# EAGLE schematic e-ink-display-v120 (EAGLE 9.2.2)
CNAME: e-ink-display; CREVISION: 0.0.3; DESIGNER: kennethlimcp

## Sheet 1 of 5: Power supply
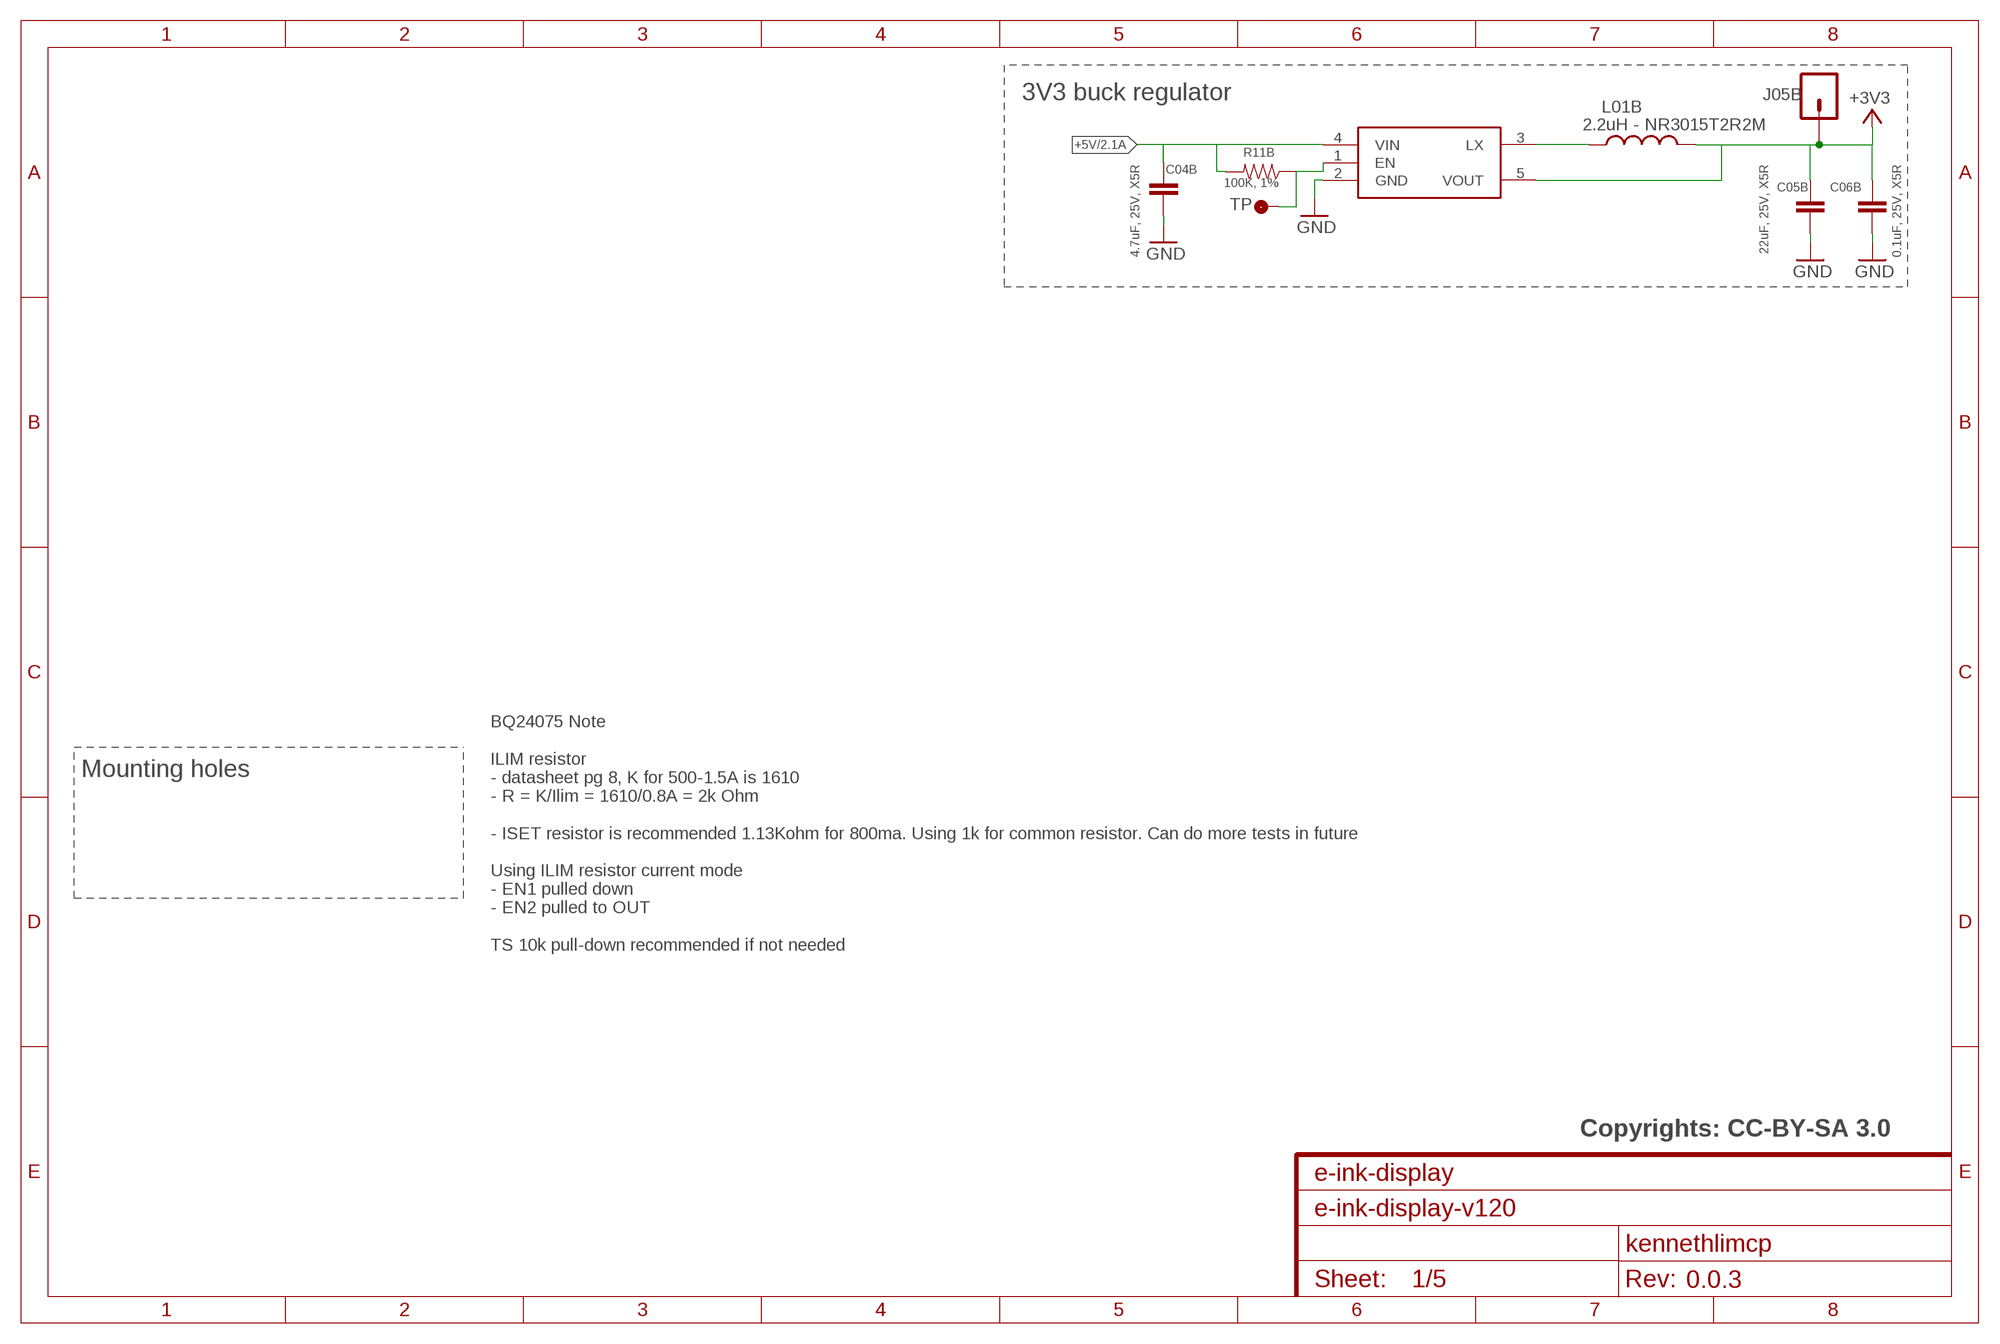
[diagram p0: schematic, sheet 1]

### Parts
C04B  4.7uF, 25V, X5R  CAP0603-CAP  [0603-CAP]
C05B  22uF, 25V, X5R  CAP0603-CAP  [0603-CAP]
C06B  0.1uF, 25V, X5R  CAP0603-CAP  [0603-CAP]
J05B  M01PTH  [1X01]
L01B  2.2uH - NR3015T2R2M  INDUCTOR-SPARKFUNNR3015T4R7M  [INDUCTOR-NR3015]
R11B  100K, 1%  RESISTOR0603-RES  [0603-RES]
TP01B  TP1  [TP35_BOT]
U02B  R8008-33  [SOT23-5]

### Nets
+3V3: C05B.2 C06B.2 J05B.1 L01B.2 U02B.5(VOUT) ; also sheet 3
+5V: C04B.2 R11B.2 U02B.4(VIN) ; also sheet 2,3
GND: C04B.1 C05B.1 C06B.1 U02B.2(GND) ; also sheet 2,3
N$21: R11B.1 TP01B.P$1(TP) U02B.1(EN)
N$23: L01B.1 U02B.3(LX)

### Notes on the sheet
- 3V3 buck regulator
- Mounting holes
- BQ24075 Note
  
  ILIM resistor
  - datasheet pg 8, K for 500-1.5A is 1610
  - R = K/Ilim = 1610/0.8A = 2k Ohm
  
  - ISET resistor is recommended 1.13Kohm for 800ma. Using 1k for common resistor. Can do more tests in future
  
  Using ILIM resistor current mode
  - EN1 pulled down
  - EN2 pulled to OUT
  
  TS 10k pull-down recommended if not needed
- Copyrights: CC-BY-SA 3.0

## Sheet 2 of 5: e-ink power supply
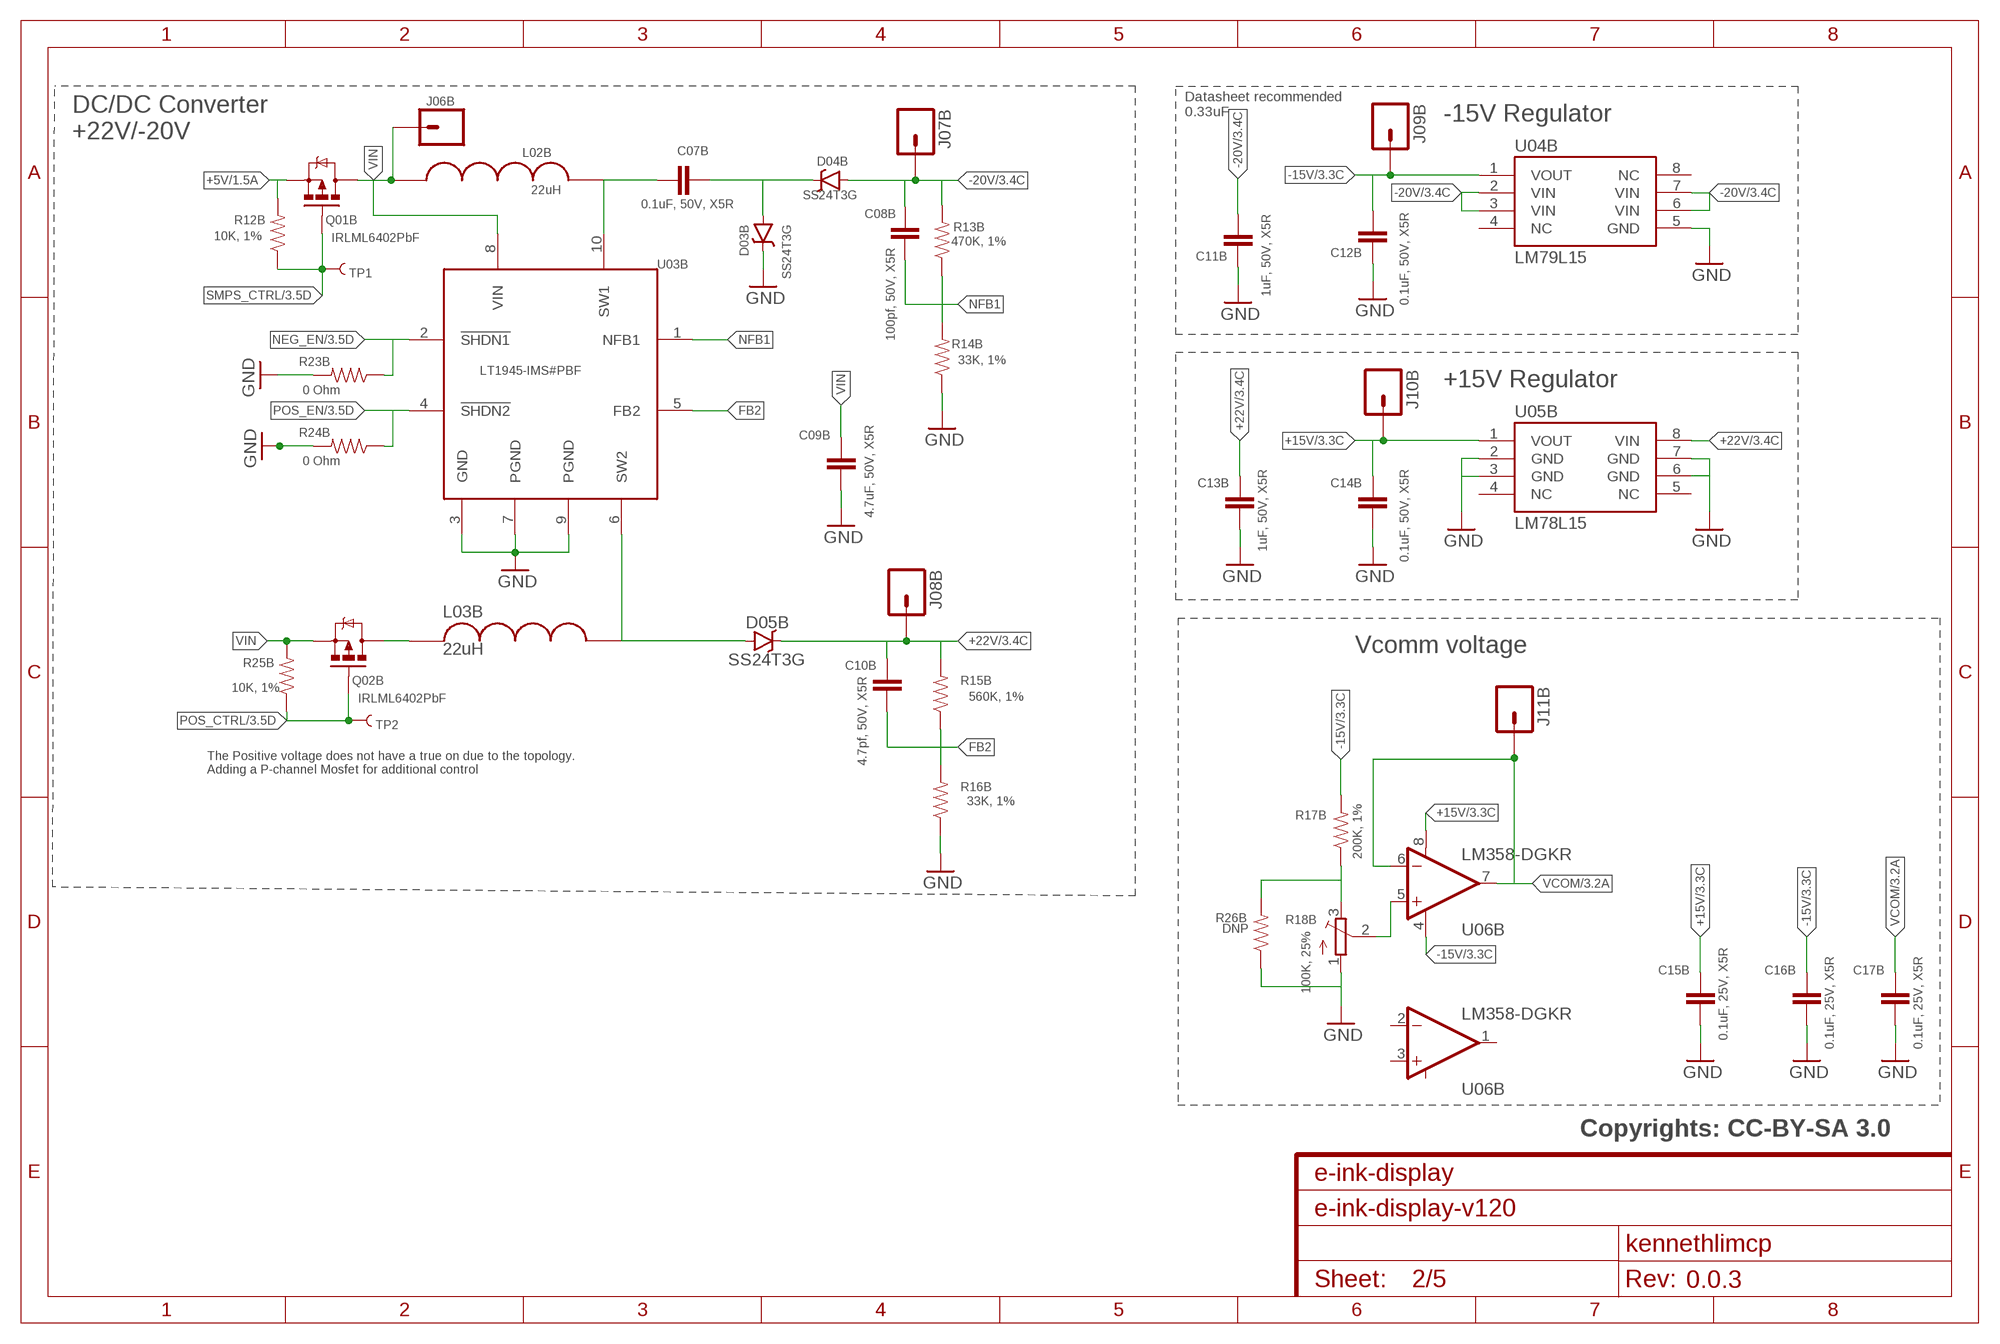
[diagram p1: schematic, sheet 2]

### Parts
C07B  0.1uF, 50V, X5R  CAP0603-CAP  [0603-CAP]
C08B  100pf, 50V, X5R  CAP0603-CAP  [0603-CAP]
C09B  4.7uF, 50V, X5R  CAP0603-CAP  [0603-CAP]
C10B  4.7pf, 50V, X5R  CAP0603-CAP  [0603-CAP]
C11B  1uF, 50V, X5R  CAP0603-CAP  [0603-CAP]
C12B  0.1uF, 50V, X5R  CAP0603-CAP  [0603-CAP]
C13B  1uF, 50V, X5R  CAP0603-CAP  [0603-CAP]
C14B  0.1uF, 50V, X5R  CAP0603-CAP  [0603-CAP]
C15B  0.1uF, 25V, X5R  CAP0603-CAP  [0603-CAP]
C16B  0.1uF, 25V, X5R  CAP0603-CAP  [0603-CAP]
C17B  0.1uF, 25V, X5R  CAP0603-CAP  [0603-CAP]
D03B  SS24T3G  DIODE-SCHOTTKY-SS24T3G  [SMA-DIODE]
D04B  SS24T3G  DIODE-SCHOTTKY-SS24T3G  [SMA-DIODE]
D05B  SS24T3G  DIODE-SCHOTTKY-SS24T3G  [SMA-DIODE]
J06B  M01PTH  [1X01]
J07B  M01PTH  [1X01]
J08B  M01PTH  [1X01]
J09B  M01PTH  [1X01]
J10B  M01PTH  [1X01]
J11B  M01PTH  [1X01]
L02B  22uH  03-INDUCTOR  [4040(1515)]
L03B  22uH  03-INDUCTOR  [4040(1515)]
Q01B  IRLML6402PbF  MOSFET-PCHANNELSMD  [SOT23-3]
Q02B  IRLML6402PbF  MOSFET-PCHANNELSMD  [SOT23-3]
R12B  10K, 1%  RESISTOR0603-RES  [0603-RES]
R13B  470K, 1%  RESISTOR0603-RES  [0603-RES]
R14B  33K, 1%  RESISTOR0603-RES  [0603-RES]
R15B  560K, 1%  RESISTOR0603-RES  [0603-RES]
R16B  33K, 1%  RESISTOR0603-RES  [0603-RES]
R17B  200K, 1%  RESISTOR0603-RES  [0603-RES]
R18B  100K, 25%  TRIMPOTTC33X  [TC33X]
R23B  0 Ohm  RESISTOR0603-RES  [0603-RES]
R24B  0 Ohm  RESISTOR0603-RES  [0603-RES]
R25B  10K, 1%  RESISTOR0603-RES  [0603-RES]
R26B  DNP  RESISTOR0603-RES  [0603-RES]
TP1  TEST-POINTRD_THRU  [TP-RD_15TH]
TP2  TEST-POINTRD_THRU  [TP-RD_15TH]
U03B  LT1945-IMS#PBF  [MSOP-10]
U04B  LM79L15  [SO08]
U05B  LM78L15  [SO08]
U06B  LM358-DGKR  [MSOP-8]

### Nets
+5V: Q01B.2(S) R12B.2 ; also sheet 1,3
+15V: C14B.2 C15B.2 J10B.1 U05B.1(VOUT) U06B.8(V+) ; also sheet 3
+22V: C10B.2 C13B.2 D05B.C J08B.1 R15B.2 U05B.8(VIN) ; also sheet 3
-15V: C12B.2 C16B.2 J09B.1 R17B.2 U04B.1(VOUT) U06B.4(V-) ; also sheet 3
-20V: C08B.2 C11B.2 D04B.A J07B.1 R13B.2 U04B.2(VIN) U04B.3(VIN) U04B.6(VIN) U04B.7(VIN) ; also sheet 3
FB2: C10B.1 R15B.1 R16B.2 U03B.5(FB2)
GND: C09B.1 C11B.1 C12B.1 C13B.1 C14B.1 C15B.1 C16B.1 C17B.1 D03B.C R14B.1 R16B.1 R18B.1(A) R23B.2 R24B.2 R26B.1 U03B.3(GND) U03B.7(PGND) U03B.9(PGND) U04B.5(GND) U05B.2(GND) U05B.3(GND) U05B.6(GND) U05B.7(GND) ; also sheet 1,3
N$2: C07B.1 L02B.P$2 U03B.10(SW1)
N$3: C07B.2 D03B.A D04B.C
N$6: R18B.2(S) U06B.5(+IN2)
N$8: D05B.A L03B.P$2 U03B.6(SW2)
N$25: L03B.P$1 Q02B.3(D)
N$36: R17B.1 R18B.3(E) R26B.2
NEG_EN: R23B.1 U03B.2(!SHDN1) ; also sheet 3
NFB1: C08B.1 R13B.1 R14B.2 U03B.1(NFB1)
POS_CTRL: Q02B.1(G) R25B.1 TP2.P$1 ; also sheet 3
POS_EN: R24B.1 U03B.4(!SHDN2) ; also sheet 3
SMPS_CTRL: Q01B.1(G) R12B.1 TP1.P$1 ; also sheet 3
VCOM: C17B.2 J11B.1 U06B.6(-IN2) U06B.7(OUT2) ; also sheet 3
VIN: C09B.2 J06B.1 L02B.P$1 Q01B.3(D) Q02B.2(S) R25B.2 U03B.8(VIN)
Unconnected: U04B.4(NC) U04B.8(NC) U05B.4(NC) U05B.5(NC) U06B.1(OUT1) U06B.2(-IN1) U06B.3(+IN1)

### Notes on the sheet
- Datasheet recommended
  0.33uF
- -15V Regulator
- DC/DC Converter
  +22V/-20V
- +15V Regulator
- Vcomm voltage
- The Positive voltage does not have a true on due to the topology. 
  Adding a P-channel Mosfet for additional control
- Copyrights: CC-BY-SA 3.0

## Sheet 3 of 5: e-ink display & MCU
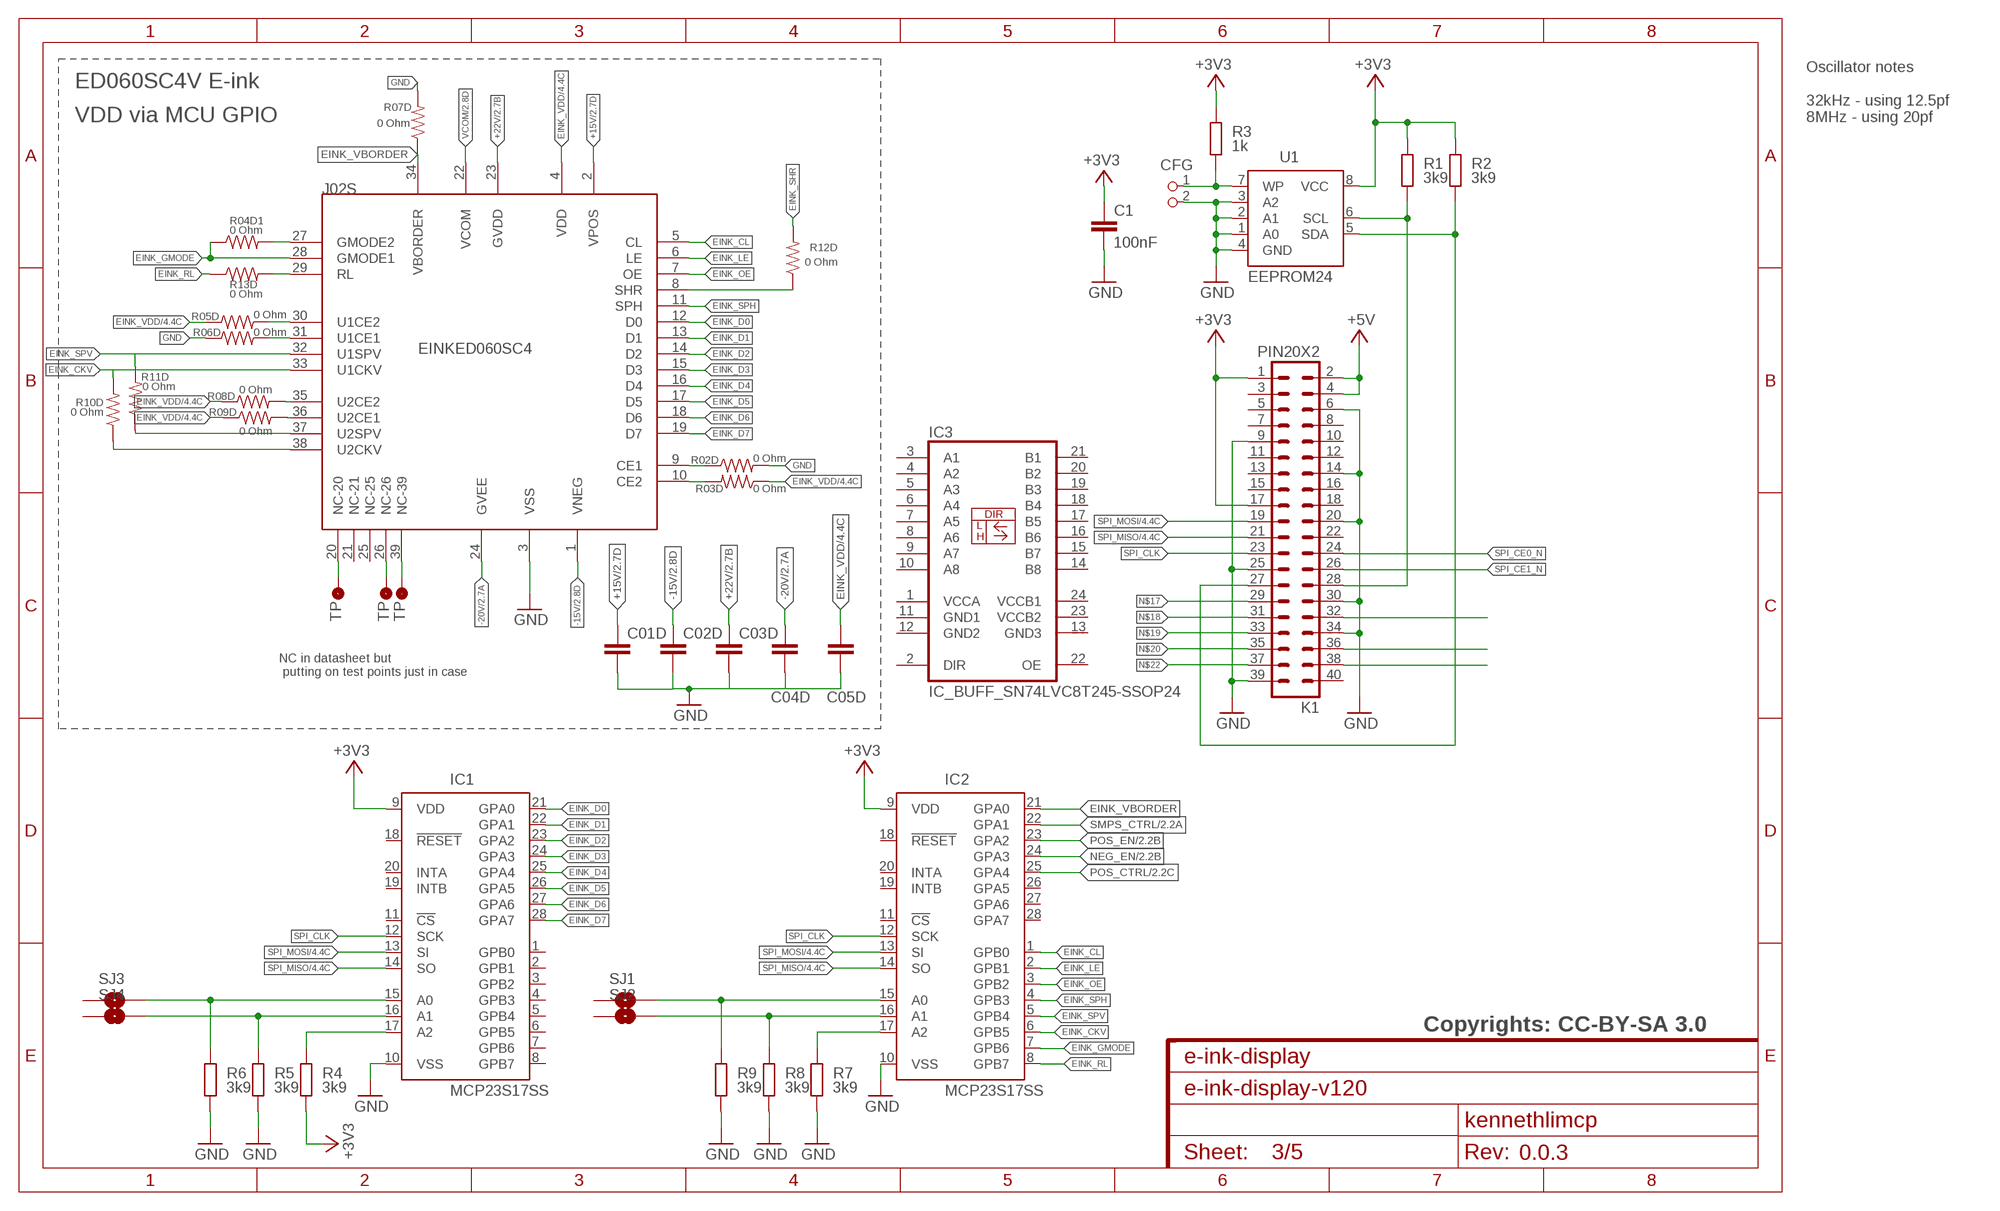
[diagram p2: schematic, sheet 3]

### Parts
C1  100nF  C-EUC0805K  [C0805K]
C01D  100nF  CAP0603-CAP  [0603-CAP]
C02D  100nF  CAP0603-CAP  [0603-CAP]
C03D  100nF  CAP0603-CAP  [0603-CAP]
C04D  100nF  CAP0603-CAP  [0603-CAP]
C05D  100nF  CAP0603-CAP  [0603-CAP]
CFG  PIN2_100  [PIN_W_2]
IC1  MCP23S17SS  [SSOP28]
IC2  MCP23S17SS  [SSOP28]
IC3  IC_BUFF_SN74LVC8T245-SSOP24  [SSOP24]
J02S  EINKED060SC4  [FPC-0.3-39]
K1  PIN20X2  [PIN_20X2]
R1  3k9  R-EU_M0805  [M0805]
R2  3k9  R-EU_M0805  [M0805]
R02D  0 Ohm  RESISTOR0603-RES  [0603-RES]
R3  1k  R-EU_M0805  [M0805]
R03D  0 Ohm  RESISTOR0603-RES  [0603-RES]
R4  3k9  R-EU_M0805  [M0805]
R04D1  0 Ohm  RESISTOR0603-RES  [0603-RES]
R5  3k9  R-EU_M0805  [M0805]
R05D  0 Ohm  RESISTOR0603-RES  [0603-RES]
R6  3k9  R-EU_M0805  [M0805]
R06D  0 Ohm  RESISTOR0603-RES  [0603-RES]
R7  3k9  R-EU_M0805  [M0805]
R07D  0 Ohm  RESISTOR0603-RES  [0603-RES]
R8  3k9  R-EU_M0805  [M0805]
R08D  0 Ohm  RESISTOR0603-RES  [0603-RES]
R9  3k9  R-EU_M0805  [M0805]
R09D  0 Ohm  RESISTOR0603-RES  [0603-RES]
R10D  0 Ohm  RESISTOR0603-RES  [0603-RES]
R11D  0 Ohm  RESISTOR0603-RES  [0603-RES]
R12D  0 Ohm  RESISTOR0603-RES  [0603-RES]
R13D  0 Ohm  RESISTOR0603-RES  [0603-RES]
SJ1  SOLDERJUMPERNO  [SJ_2S-NO]
SJ2  SOLDERJUMPERNO  [SJ_2S-NO]
SJ3  SOLDERJUMPERNO  [SJ_2S-NO]
SJ4  SOLDERJUMPERNO  [SJ_2S-NO]
U1  EEPROM24  [SOIC8]
U$1  TP1  [TP35_BOT]
U$8  TP1  [TP35_BOT]
U$9  TP1  [TP35_BOT]

### Nets
+3V3: C1.1 IC1.9(VDD) IC2.9(VDD) K1.1 K1.17 R1.2 R2.2 R3.2 R4.1 U1.8(VCC) ; also sheet 1
+5V: K1.2 K1.4 ; also sheet 1,2
+15V: C01D.1 J02S.2(VPOS) ; also sheet 2
+22V: C03D.1 J02S.23(GVDD) ; also sheet 2
-15V: C02D.1 J02S.1(VNEG) ; also sheet 2
-20V: C04D.1 J02S.24(GVEE) ; also sheet 2
CE2: J02S.10(CE2) R03D.2
EINK_CKV: IC2.6(GPB5) J02S.33(U1CKV) R10D.2
EINK_CL: IC2.1(GPB0) J02S.5(CL)
EINK_D0: IC1.21(GPA0) J02S.12(D0)
EINK_D1: IC1.22(GPA1) J02S.13(D1)
EINK_D2: IC1.23(GPA2) J02S.14(D2)
EINK_D3: IC1.24(GPA3) J02S.15(D3)
EINK_D4: IC1.25(GPA4) J02S.16(D4)
EINK_D5: IC1.26(GPA5) J02S.17(D5)
EINK_D6: IC1.27(GPA6) J02S.18(D6)
EINK_D7: IC1.28(GPA7) J02S.19(D7)
EINK_GMODE: IC2.7(GPB6) J02S.28(GMODE1) R04D1.1
EINK_LE: IC2.2(GPB1) J02S.6(LE)
EINK_OE: IC2.3(GPB2) J02S.7(OE)
EINK_RL: IC2.8(GPB7) R13D.1
EINK_SHR: R12D.2
EINK_SPH: IC2.4(GPB3) J02S.11(SPH)
EINK_SPV: IC2.5(GPB4) J02S.32(U1SPV) R11D.2
EINK_VBORDER: IC2.21(GPA0) J02S.34(VBORDER) R07D.1
EINK_VDD: C05D.1 J02S.4(VDD) R03D.1 R05D.1 R08D.1 R09D.1 ; also sheet 4
GND: C1.2 C01D.2 C02D.2 C03D.2 C04D.2 C05D.2 CFG.2 IC1.10(VSS) IC2.10(VSS) J02S.3(VSS) K1.6 K1.9 K1.14 K1.20 K1.25 K1.30 K1.34 K1.39 R02D.2 R5.1 R6.1 R06D.1 R7.1 R07D.2 R8.1 R9.1 U1.1(A0) U1.2(A1) U1.3(A2) U1.4(GND) ; also sheet 1,2
N$1: IC2.17(A2) R7.2
N$4: K1.28 R1.1 U1.6(SCL)
N$5: J02S.31(U1CE1) R06D.2
N$7: K1.27 R2.1 U1.5(SDA)
N$9: CFG.1 R3.1 U1.7(WP)
N$10: IC1.17(A2) R4.2
N$11: IC1.16(A1) R5.2 SJ4.2
N$12: IC1.15(A0) R6.2 SJ3.2
N$13: J02S.27(GMODE2) R04D1.2
N$14: IC2.16(A1) R8.2 SJ2.2
N$15: IC2.15(A0) R9.2 SJ1.2
N$17: K1.29
N$18: K1.31
N$19: K1.33
N$20: K1.35
N$22: K1.37
N$24: J02S.29(RL) R13D.2
N$26: J02S.35(U2CE2) R08D.2
N$27: J02S.36(U2CE1) R09D.2
N$28: J02S.9(CE1) R02D.1
N$29: J02S.20(NC-20) U$1.P$1(TP)
N$30: K1.32
N$31: J02S.26(NC-26) U$8.P$1(TP)
N$32: J02S.8(SHR) R12D.1
N$33: J02S.39(NC-39) U$9.P$1(TP)
N$34: K1.36
N$35: K1.38
NEG_EN: IC2.24(GPA3) ; also sheet 2
POS_CTRL: IC2.25(GPA4) ; also sheet 2
POS_EN: IC2.23(GPA2) ; also sheet 2
SMPS_CTRL: IC2.22(GPA1) ; also sheet 2
SPI_CE0_N: K1.24
SPI_CE1_N: K1.26
SPI_CLK: IC1.12(SCK) IC2.12(SCK) K1.23
SPI_MISO: IC1.14(SO) IC2.14(SO) K1.21 ; also sheet 4
SPI_MOSI: IC1.13(SI) IC2.13(SI) K1.19 ; also sheet 4
U1CE2: J02S.30(U1CE2) R05D.2
U2CKV: J02S.38(U2CKV) R10D.1
U2SPV: J02S.37(U2SPV) R11D.1
VCOM: J02S.22(VCOM) ; also sheet 2
Unconnected: IC1.1(GPB0) IC1.2(GPB1) IC1.3(GPB2) IC1.4(GPB3) IC1.5(GPB4) IC1.6(GPB5) IC1.7(GPB6) IC1.8(GPB7) IC1.11(!CS) IC1.18(!RESET) IC1.19(INTB) IC1.20(INTA) IC2.11(!CS) IC2.18(!RESET) IC2.19(INTB) IC2.20(INTA) IC2.26(GPA5) IC2.27(GPA6) IC2.28(GPA7) IC3.2(DIR) IC3.3(A1) IC3.4(A2) IC3.5(A3) IC3.6(A4) IC3.7(A5) IC3.8(A6) IC3.9(A7) IC3.10(A8) IC3.14(B8) IC3.15(B7) IC3.16(B6) IC3.17(B5) IC3.18(B4) IC3.19(B3) IC3.20(B2) IC3.21(B1) IC3.22(OE) J02S.21(NC-21) J02S.25(NC-25) K1.3 K1.5 K1.7 K1.8 K1.10 K1.11 K1.12 K1.13 K1.15 K1.16 K1.18 K1.22 K1.40 SJ1.1 SJ2.1 SJ3.1 SJ4.1

### Notes on the sheet
- ED060SC4V E-ink
  
  VDD via MCU GPIO
- Oscillator notes
  
  32kHz - using 12.5pf
  8MHz - using 20pf
- NC in datasheet but
   putting on test points just in case
- Copyrights: CC-BY-SA 3.0

## Sheet 4 of 5: Peripherals
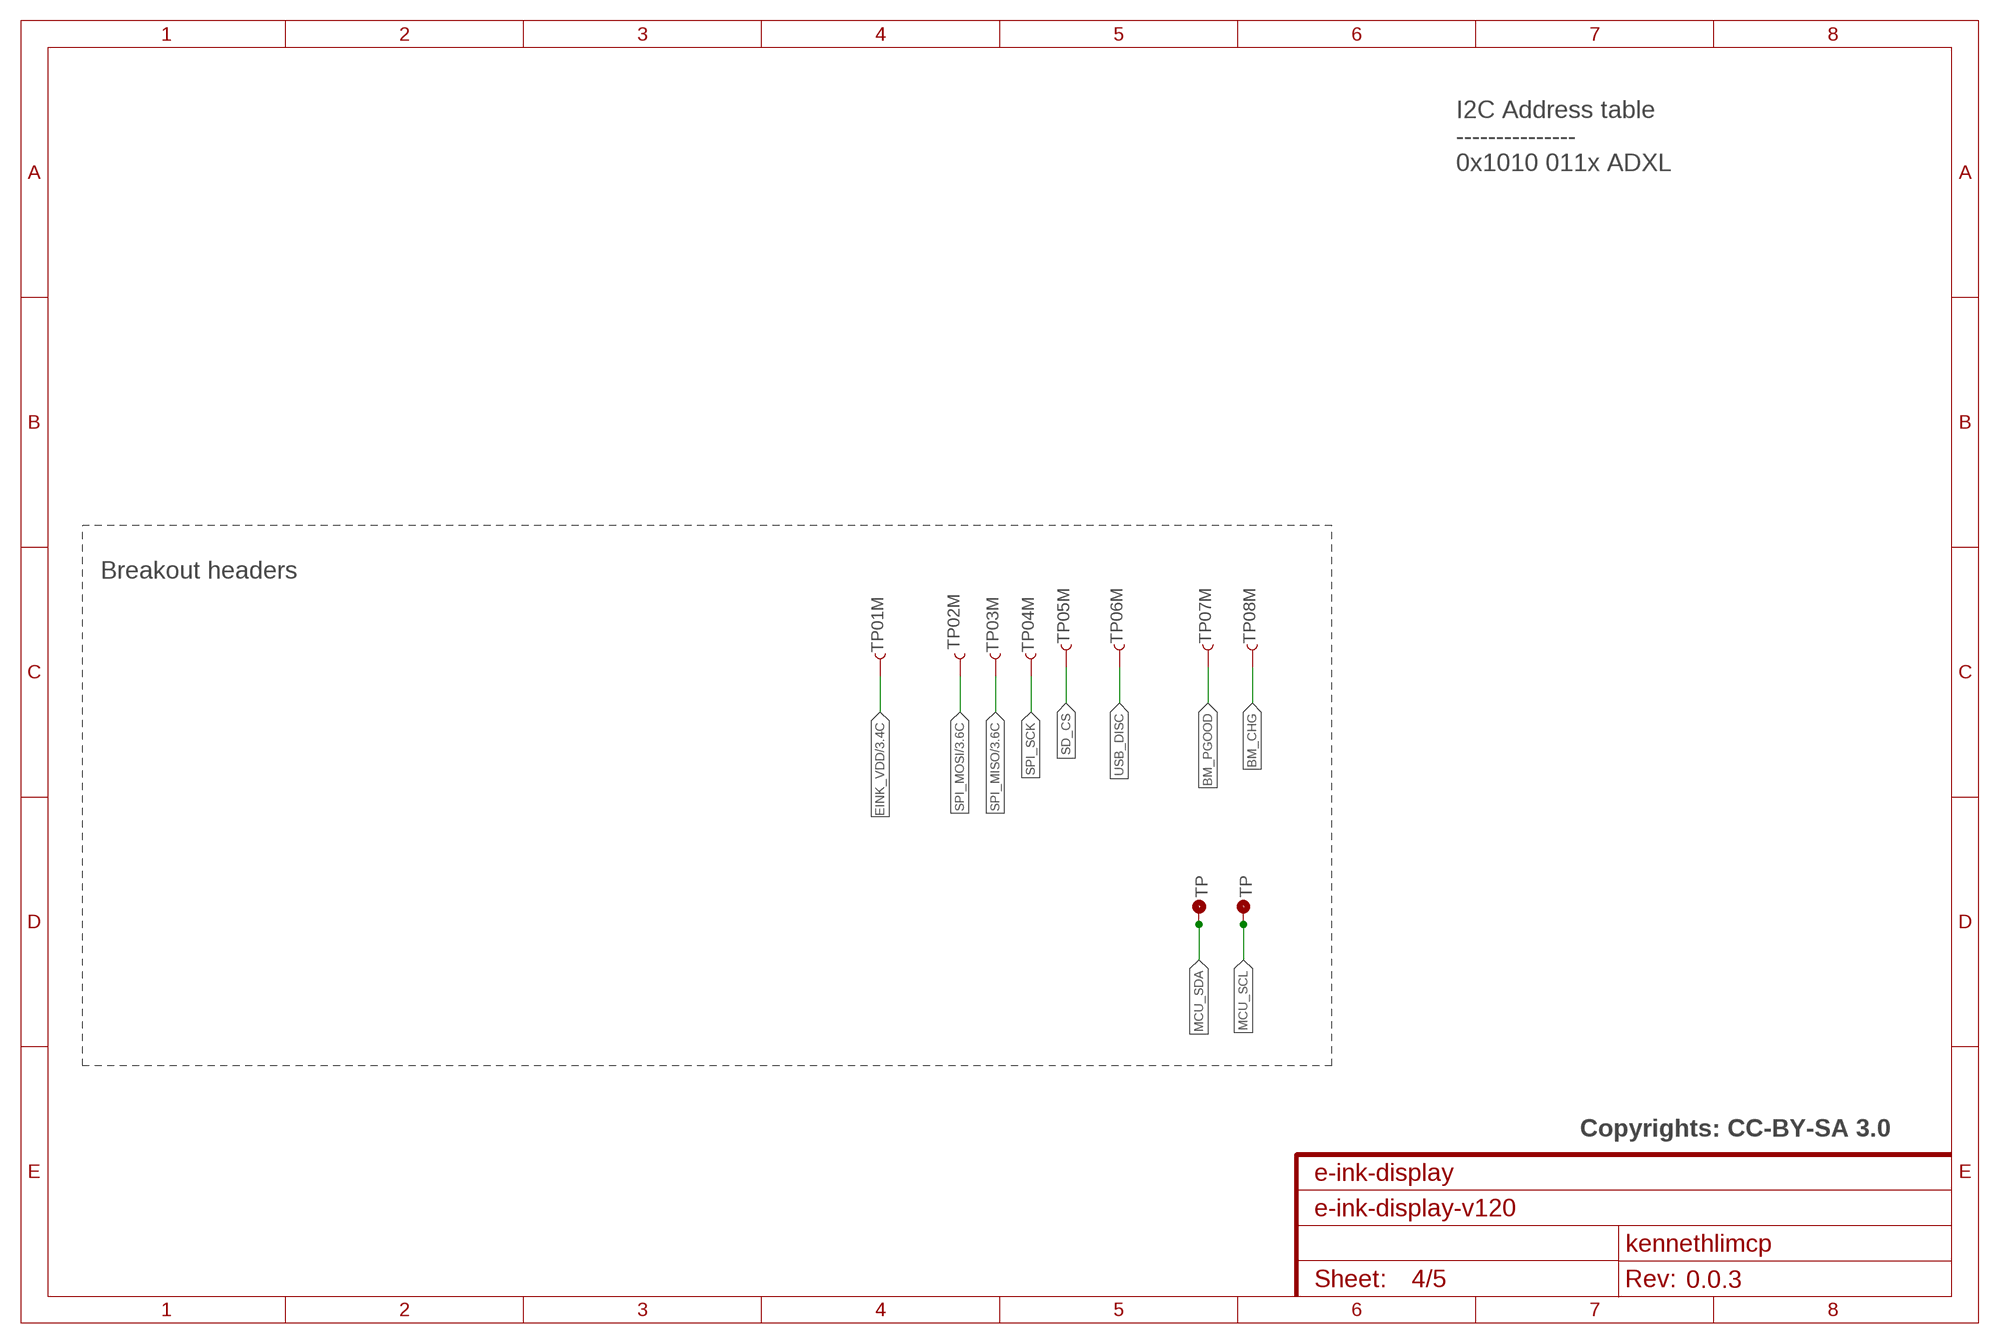
[diagram p3: schematic, sheet 4]

### Parts
TP01M  TEST-POINTRD_THRU  [TP-RD_15TH]
TP02M  TEST-POINTRD_THRU  [TP-RD_15TH]
TP03M  TEST-POINTTP_15TH_THRU  [TP_15TH]
TP04M  TEST-POINTRD_THRU  [TP-RD_15TH]
TP05M  TEST-POINTRD_THRU  [TP-RD_15TH]
TP06M  TEST-POINTRD_THRU  [TP-RD_15TH]
TP07M  TEST-POINTRD_THRU  [TP-RD_15TH]
TP08M  TEST-POINTRD_THRU  [TP-RD_15TH]
TP17M  TP1  [TP35_BOT]
TP18M  TP1  [TP35_BOT]

### Nets
BM_CHG: TP08M.P$1
BM_PGOOD: TP07M.P$1
EINK_VDD: TP01M.P$1 ; also sheet 3
MCU_SCL: TP18M.P$1(TP)
MCU_SDA: TP17M.P$1(TP)
SD_CS: TP05M.P$1
SPI_MISO: TP03M.P$1 ; also sheet 3
SPI_MOSI: TP02M.P$1 ; also sheet 3
SPI_SCK: TP04M.P$1
USB_DISC: TP06M.P$1

### Notes on the sheet
- I2C Address table
  ---------------
  0x1010 011x ADXL
- Breakout headers
- Copyrights: CC-BY-SA 3.0

## Sheet 5 of 5
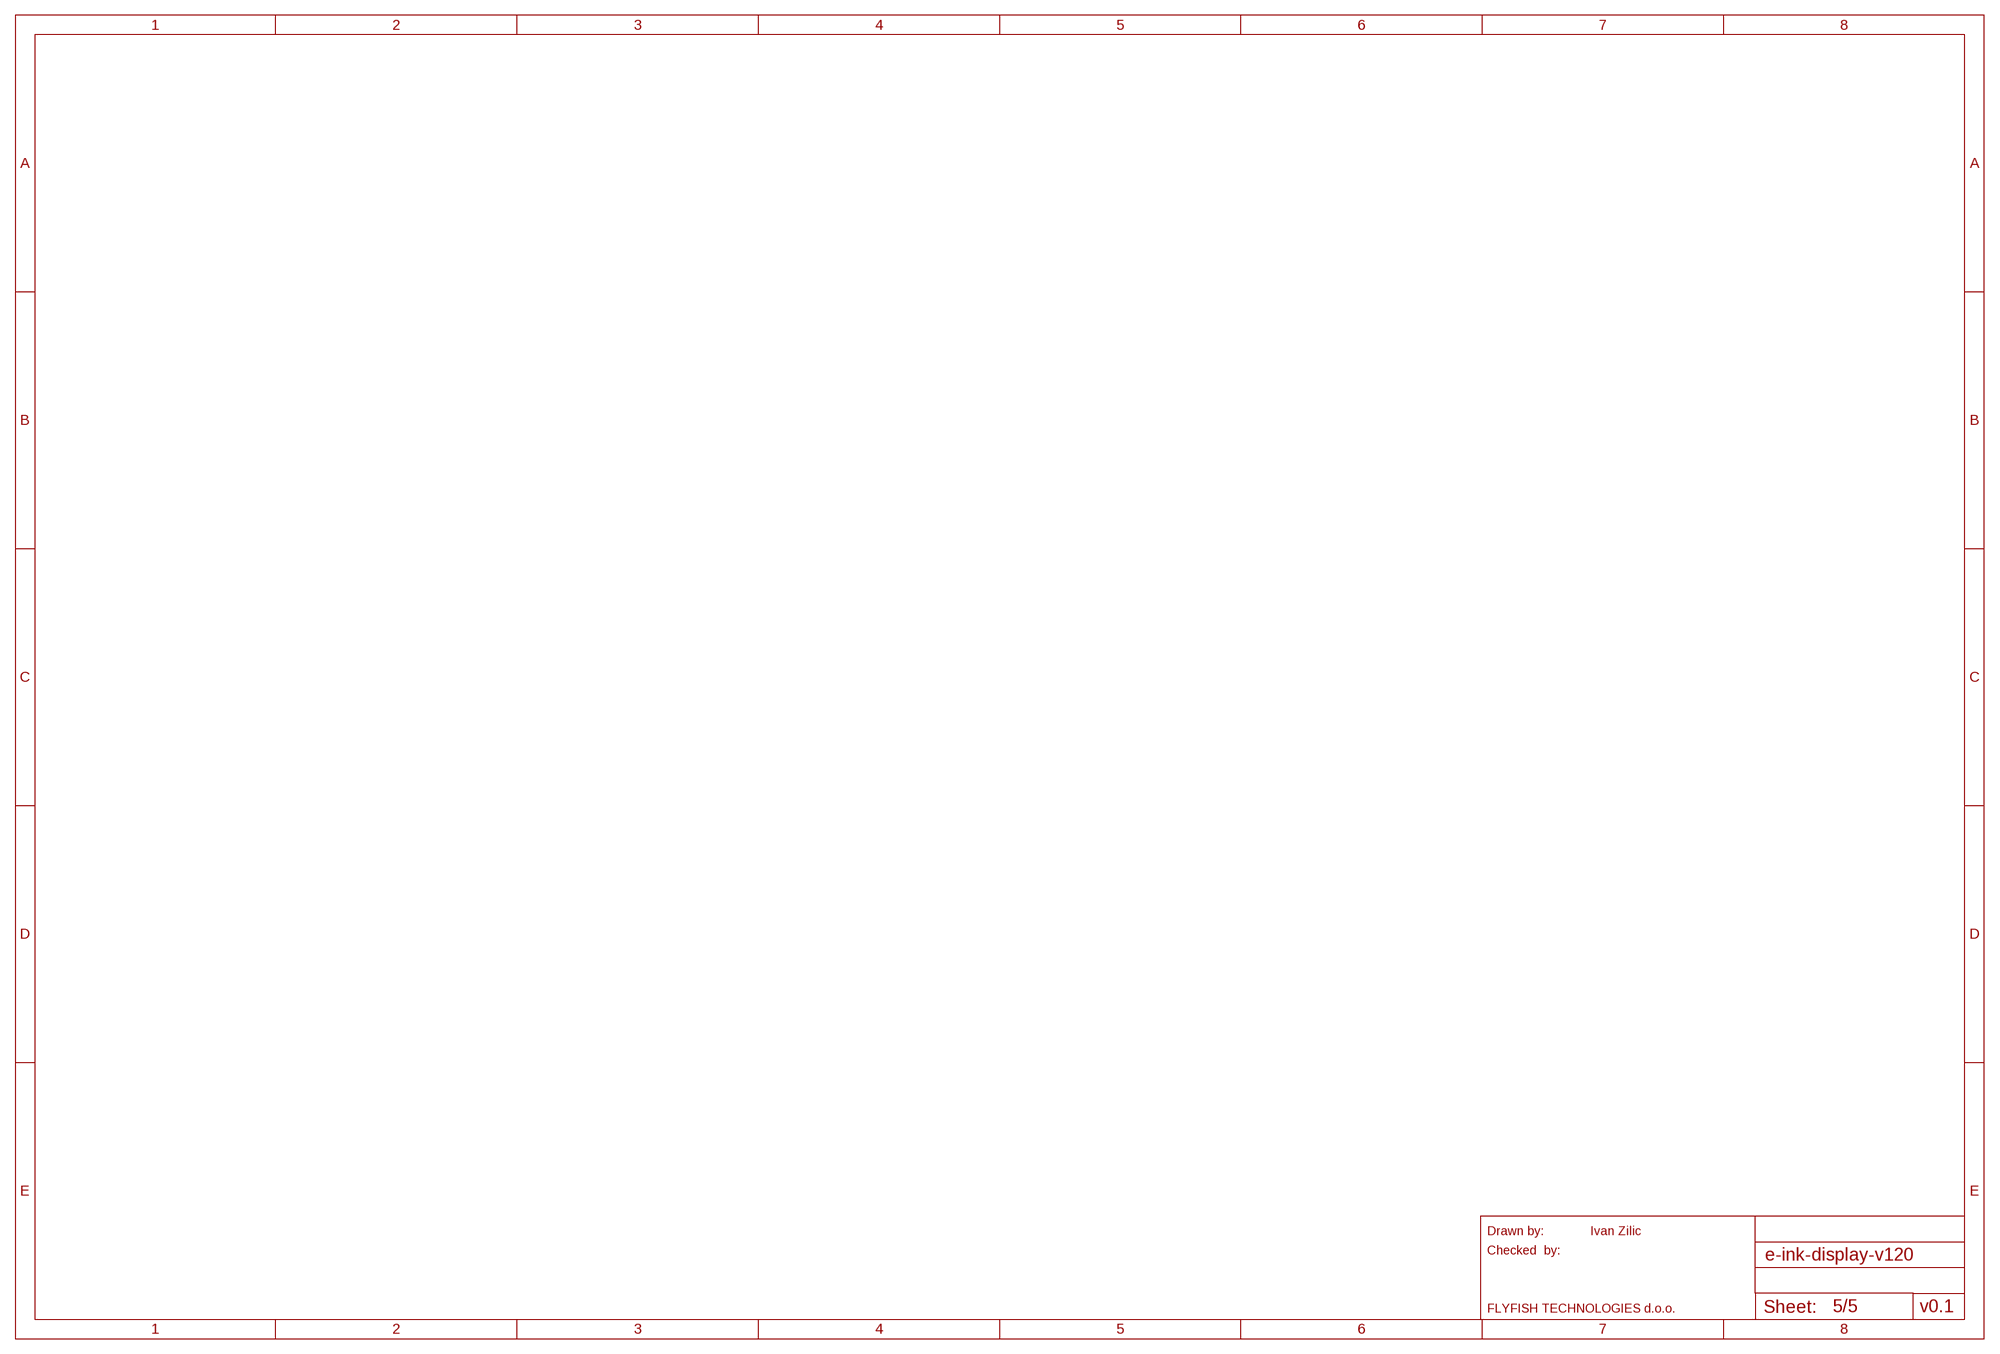
[diagram p4: schematic, sheet 5]

### Notes on the sheet
- Drawn by: | Ivan Zilic
- Checked  by:
- FLYFISH TECHNOLOGIES d.o.o. | v0.1

## Power pins joined to a net without a drawn wire
GND1: IC3.11(GND1)
GND2: IC3.12(GND2)
GND3: IC3.13(GND3)
VCCA: IC3.1(VCCA)
VCCB1: IC3.24(VCCB1)
VCCB2: IC3.23(VCCB2)

## Library data of the parts
C1 = resistor:C-EU: CAPACITOR, European symbol; DIELECTRIC: X7R
C01D C02D C03D C04B C04D C05B C05D C06B C07B C08B C09B C10B C11B C12B C13B C14B C15B C16B C17B = SparkFun-Capacitors:CAP: Capacitor Standard 0603 ceramic capacitor, and 0.1" leaded capacitor.
CFG = FLYFISH:PIN2
D03B D04B D05B = kennethlimcp:DIODE-SCHOTTKY: Schottky Diodes SS24T3G - Schottky diode 40V, 1A, Vf 500mV Package: DO-214AA
IC1 IC2 = microchip:MCP23S17: http://ww1.microchip.com/downloads/en/DeviceDoc/21952a.pdf Source: http://ww1.microchip.com/downloads/en/DeviceDoc/21952a.pdf; MF: MICROCHIP; MPN: MCP23S17-E/SS; OC_FARNELL: 1467675; OC_NEWARK: 31K2952
IC3 = Monkey_Wrench_Manufacturing_Official:IC_BUFF_SN74LVC8T245
J02S = kennethlimcp:EINK
J05B J06B J07B J08B J09B J10B J11B = SparkFun-Connectors:M01: Header 1 Standard 1-pin 0.1" header. Use with straight break away headers (SKU : PRT-00116), right angle break away headers (PRT-00553), swiss pins (PRT-00743), machine pins (PRT-00117), and female headers (PRT-00115).
K1 = FLYFISH:PIN20X2
L01B = Spark:INDUCTOR-SPARKFUN: Inductors Basic Inductor/Choke - 0603 and 1206. Footprints are not proven and vary greatly between part numbers. SRN6045- 33uH, 20% 1.4A; NR3015T4R7M: 4.7uH
L02B L03B = kennethlimcp:03-INDUCTOR
Q01B Q02B = SparkFun-DiscreteSemi:MOSFET-PCHANNEL: Generic PMOSFET IRLML2244 - TRANS-11153 (SOT-23 -20V -4.3A) (1.Gate 2.Source 3.Drain) FQP27P06 - COM-10349 <http://www.sparkfun.com/products/10349> (TO-220 -60V -27A) (1.Gate 2.Source 3.Drain)
R1-R9 = resistor:R-EU_: RESISTOR, European symbol; TOLERANCE: 5%
R02D R03D R04D1 R05D R06D R07D R08D R09D R10D R11B R11D R12B R12D R13B R13D R14B R15B R16B R17B R23B R24B R25B R26B = kennethlimcp:RESISTOR: Resistor Basic schematic elements and footprints for 0603, 1206, and PTH resistors.
R18B = adafruit:TRIMPOT: SMT trimmer potentiometer part number TC33X http://www.ladyada.net/library/eagle
SJ1-SJ4 = SuperPi:SOLDERJUMPER: Solder Jumper Standard SMD solder jumper. Used to automate production. Two varients : Normally Open and Normally Closed are the same, but have different paste layers. NC will have a large amount of paste and should jumper during reflow.
TP1 TP01M TP2 TP02M TP04M TP05M TP06M TP07M TP08M = kennethlimcp:TEST-POINT: Bare copper test points for troubleshooting or ICT
TP01B TP17M TP18M U$1 U$8 U$9 = Spark:TP: Test Points of all sizes and shapes
TP03M = SparkFun-Passives:TEST-POINT: Bare copper test points for troubleshooting or ICT
U1 = FLYFISH:EEPROM24
U02B = Spark:R8008-33
U03B = kennethlimcp:LT1945: LT1945 36V switch, 350mA, Dual micropower DC/DC converter
U04B = kennethlimcp:LM79L15: LM79L15, SOIC-8
U05B = kennethlimcp:LM78L15: LM78L15, SOIC-8
U06B = kennethlimcp:LM358: LM358, two independent, high-gain, Wide Supply Ranges frequency-compensated operational amplifiers MSOP-8

## Net classes
0 default: clearance 0.205 mm